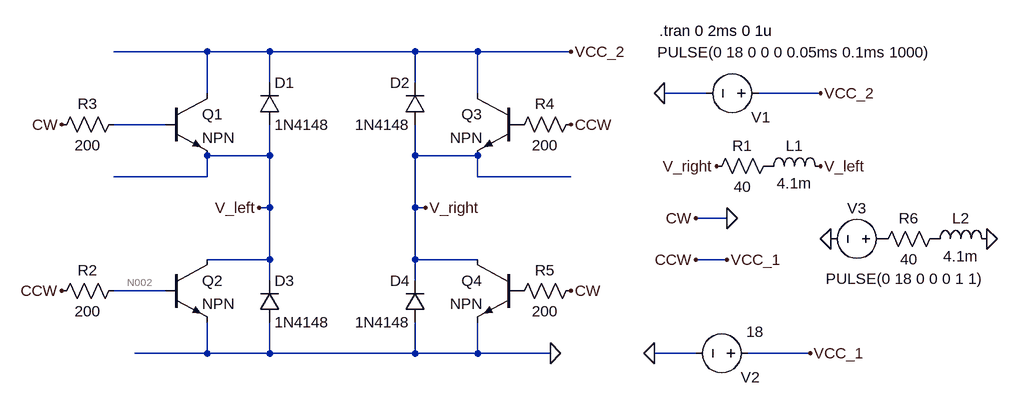
[diagram p0: schematic Hbro_test_setup.asc]
Hbro_test_setup.asc, the LTspice schematic file:
Version 4
SHEET 1 1652 680
WIRE 96 -16 -48 -16
WIRE 192 -16 96 -16
WIRE 416 -16 192 -16
WIRE 512 -16 416 -16
WIRE 656 -16 512 -16
WIRE 192 32 192 -16
WIRE 416 32 416 -16
WIRE 96 48 96 -16
WIRE 512 48 512 -16
WIRE 864 48 800 48
WIRE 1040 48 944 48
WIRE 32 96 -48 96
WIRE 192 144 192 96
WIRE 192 144 96 144
WIRE 416 144 416 96
WIRE 512 144 416 144
WIRE 96 176 96 144
WIRE 96 176 -48 176
WIRE 512 176 512 144
WIRE 656 176 512 176
WIRE 192 224 192 144
WIRE 192 224 176 224
WIRE 416 224 416 144
WIRE 432 224 416 224
WIRE 896 240 848 240
WIRE 192 304 192 224
WIRE 192 304 96 304
WIRE 416 304 416 224
WIRE 512 304 416 304
WIRE 896 304 848 304
WIRE 192 336 192 304
WIRE 416 336 416 304
WIRE 32 352 -48 352
WIRE 96 448 96 400
WIRE 96 448 -16 448
WIRE 192 448 192 400
WIRE 192 448 96 448
WIRE 416 448 416 400
WIRE 416 448 192 448
WIRE 512 448 512 400
WIRE 512 448 416 448
WIRE 624 448 512 448
WIRE 848 448 784 448
WIRE 1024 448 928 448
FLAG 1040 48 VCC_2
FLAG 848 240 CW
FLAG 848 304 CCW
FLAG 176 224 V_left
FLAG 432 224 V_right
FLAG 896 240 0
FLAG 800 48 0
FLAG -128 352 CCW
FLAG -128 96 CW
FLAG 656 -16 VCC_2
FLAG 624 448 0
FLAG 880 160 V_right
FLAG 1040 160 V_left
FLAG 784 448 0
FLAG 1024 448 VCC_1
FLAG 896 304 VCC_1
FLAG 656 96 CCW
FLAG 656 352 CW
FLAG 1296 272 0
FLAG 1056 272 0
SYMBOL npn 32 48 R0
SYMATTR InstName Q1
SYMBOL npn 32 304 R0
SYMATTR InstName Q2
SYMBOL npn 576 48 M0
SYMATTR InstName Q3
SYMBOL npn 576 304 M0
SYMATTR InstName Q4
SYMBOL ind 944 176 R270
WINDOW 0 32 56 VTop 2
WINDOW 3 5 56 VBottom 2
SYMATTR InstName L1
SYMATTR Value 4.1m
SYMBOL res 864 176 R270
WINDOW 0 32 56 VTop 2
WINDOW 3 0 56 VBottom 2
SYMATTR InstName R1
SYMATTR Value 40
SYMBOL voltage 960 48 R90
WINDOW 0 37 -3 VRight 2
WINDOW 3 -63 -251 VRight 2
WINDOW 123 0 0 Left 0
WINDOW 39 0 0 Left 0
SYMATTR InstName V1
SYMATTR Value PULSE(0 18 0 0 0 0.05ms 0.1ms 1000)
SYMBOL diode 176 96 M180
WINDOW 0 24 64 Left 2
WINDOW 3 24 0 Left 2
SYMATTR InstName D1
SYMATTR Value 1N4148
SYMBOL diode 432 96 R180
WINDOW 0 24 64 Left 2
WINDOW 3 24 0 Left 2
SYMATTR InstName D2
SYMATTR Value 1N4148
SYMBOL diode 176 400 M180
WINDOW 0 24 64 Left 2
WINDOW 3 24 0 Left 2
SYMATTR InstName D3
SYMATTR Value 1N4148
SYMBOL diode 432 400 R180
WINDOW 0 24 64 Left 2
WINDOW 3 24 0 Left 2
SYMATTR InstName D4
SYMATTR Value 1N4148
SYMBOL voltage 944 448 R90
WINDOW 0 37 -3 VRight 2
WINDOW 3 -33 -9 VRight 2
WINDOW 123 0 0 Left 0
WINDOW 39 0 0 Left 0
SYMATTR InstName V2
SYMATTR Value 18
SYMBOL res -32 336 R90
WINDOW 0 0 56 VBottom 2
WINDOW 3 32 56 VTop 2
SYMATTR InstName R2
SYMATTR Value 200
SYMBOL res -32 80 R90
WINDOW 0 0 56 VBottom 2
WINDOW 3 32 56 VTop 2
SYMATTR InstName R3
SYMATTR Value 200
SYMBOL res 560 112 R270
WINDOW 0 32 56 VTop 2
WINDOW 3 0 56 VBottom 2
SYMATTR InstName R4
SYMATTR Value 200
SYMBOL res 560 368 R270
WINDOW 0 32 56 VTop 2
WINDOW 3 0 56 VBottom 2
SYMATTR InstName R5
SYMATTR Value 200
SYMBOL ind 1200 288 R270
WINDOW 0 32 56 VTop 2
WINDOW 3 5 56 VBottom 2
SYMATTR InstName L2
SYMATTR Value 4.1m
SYMBOL res 1120 288 R270
WINDOW 0 32 56 VTop 2
WINDOW 3 0 56 VBottom 2
SYMATTR InstName R6
SYMATTR Value 40
SYMBOL voltage 1152 272 R90
WINDOW 0 -32 56 VBottom 2
WINDOW 3 46 -18 VTop 2
WINDOW 123 0 0 Left 0
WINDOW 39 0 0 Left 0
SYMATTR InstName V3
SYMATTR Value PULSE(0 18 0 0 0 1 1)
TEXT 792 -48 Left 2 !.tran 0 2ms 0 1u

The netlist it stands for:
* Hbro_test_setup.asc
Q1 VCC_2 N001 V_left 0 NPN
Q2 V_left N002 0 0 NPN
Q3 VCC_2 P001 V_right 0 NPN
Q4 V_right P002 0 0 NPN
L1 P003 V_left 4.1m
R1 V_right P003 40
V1 VCC_2 0 PULSE(0 18 0 0 0 0.05ms 0.1ms 1000)
D1 V_left VCC_2 1N4148
D2 V_right VCC_2 1N4148
D3 0 V_left 1N4148
D4 0 V_right 1N4148
V2 VCC_1 0 18
R2 N002 VCC_1 200
R3 N001 0 200
R4 P001 VCC_1 200
R5 P002 0 200
L2 P004 0 4.1m
R6 P005 P004 40
V3 P005 0 PULSE(0 18 0 0 0 1 1)
.model D D
.lib standard.dio
.model NPN NPN
.model PNP PNP
.lib standard.bjt
.tran 0 2ms 0 1u
.backanno
.end

* Results of the author's LTspice run, read from the files saved beside the schematic
* Operating Point, zero values left out:
*   V(v_left) = 17.86 mV
*   V(n002) = 906.6 mV
*   V(p001) = 889.1 mV
*   V(v_right) = 391 µV
*   V(p003) = 17.86 mV
*   V(vcc_1) = 18 V
*   Ic(Q2) = -436.7 µA
*   Ib(Q2) = 85.47 mA
*   Ie(Q2) = -85.03 mA
*   Ic(Q3) = -85.99 mA
*   Ib(Q3) = 85.55 mA
*   Ie(Q3) = 436.7 µA
*   I(D1) = 1.217 nA
*   I(D2) = 21.84 pA
*   I(D3) = -820.9 pA
*   I(D4) = -21.65 pA
*   I(L1) = -436.7 µA
*   I(R1) = -436.7 µA
*   I(R2) = -85.47 mA
*   I(R4) = -85.55 mA
*   I(V1) = 85.99 mA
*   I(V2) = -171 mA
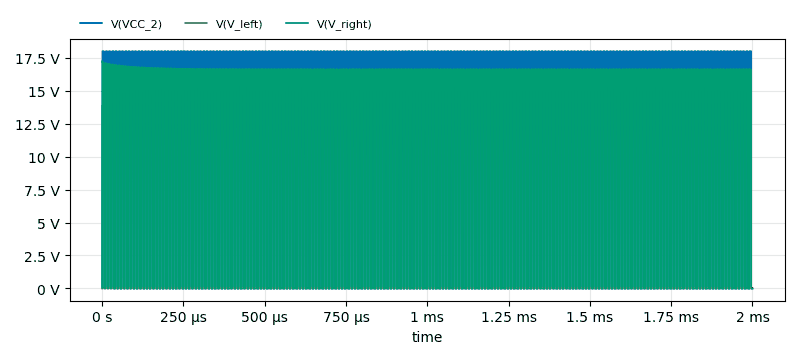
[diagram p1: Transient Analysis of Hbro_test_setup.asc, plotted from the saved traces]
* Transient Analysis, 1 run:
*   V(VCC_2): min 0 V, max 18 V, average 9.9 V, rms 13.15 V, last 0 V
*   V(V_left): min 17.86 mV, max 40.94 mV, average 39.72 mV, rms 39.83 mV, last 40.31 mV
*   V(V_right): min -34.47 mV, max 17.24 V, average 9.205 V, rms 12.22 V, last -33.71 mV